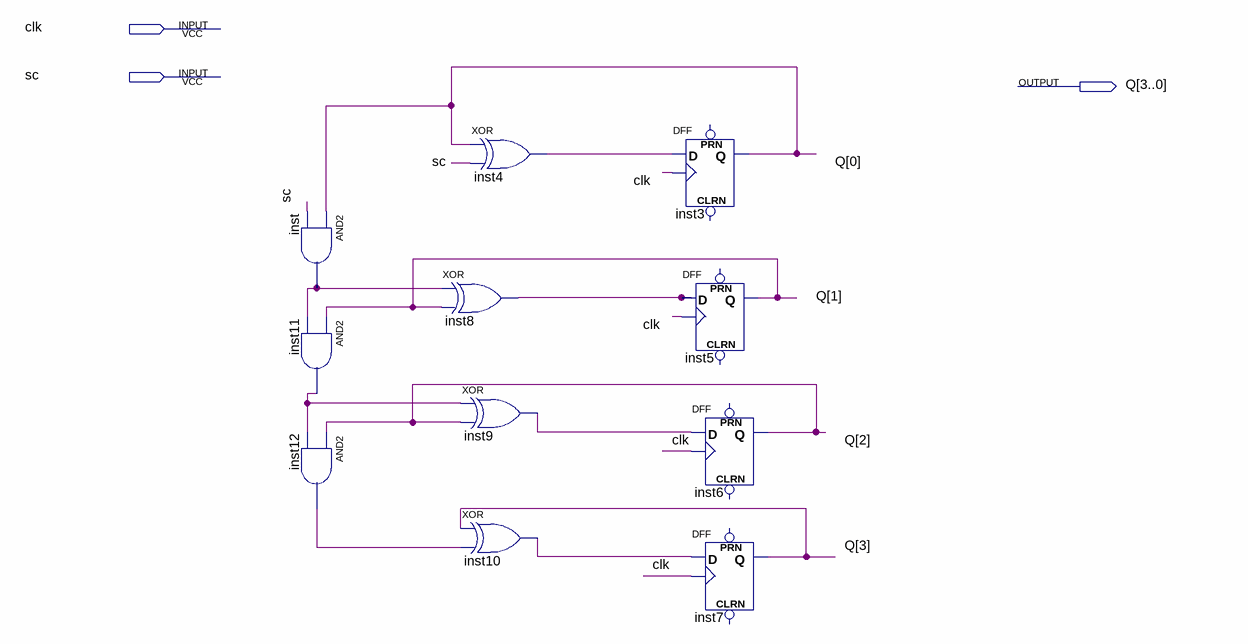
[diagram p0: schematic sheet]
// Quartus schematic g14_count4.bdf as structural Verilog: 11 symbols, 3 pins
module g14_count4 (
  input  clk,
  input  sc,
  output [3:0] Q
);

  wire inst4_out, inst8_out, inst9_out, inst10_out, inst11_out, inst12_out, inst_out;

  and inst (inst_out, Q[0], sc);
  and inst11 (inst11_out, Q[1], inst_out);
  and inst12 (inst12_out, Q[2], inst11_out);
  xor inst8 (inst8_out, inst_out, Q[1]);
  xor inst9 (inst9_out, inst11_out, Q[2]);
  xor inst10 (inst10_out, Q[3], inst12_out);
  xor inst4 (inst4_out, Q[0], sc);
  DFF inst3 (.CLK(clk), .D(inst4_out), .Q(Q[0]));  // open: CLRN, PRN
  DFF inst5 (.CLK(clk), .D(inst8_out), .Q(Q[1]));  // open: CLRN, PRN
  DFF inst6 (.CLK(clk), .D(inst9_out), .Q(Q[2]));  // open: CLRN, PRN
  DFF inst7 (.CLK(clk), .D(inst10_out), .Q(Q[3]));  // open: CLRN, PRN
endmodule
